# Altium schematic sheet SuperFin Baseboard pg5.SchDoc
size A
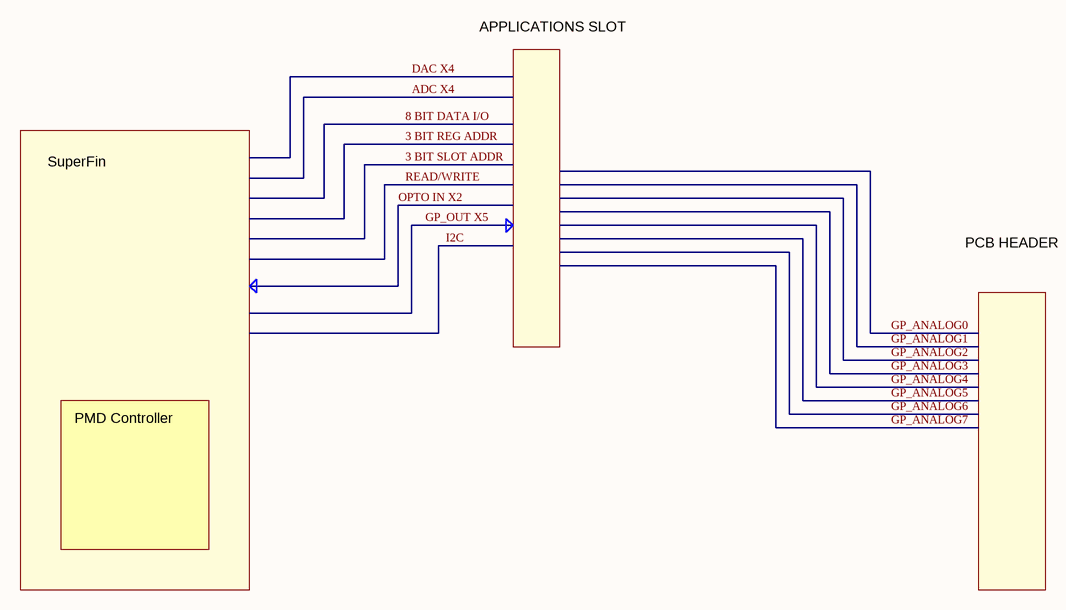
[diagram p0: SuperFin Baseboard pg5.SchDoc]

## Buses and harness runs
bus 3 BIT REG ADDR
bus 3 BIT SLOT ADDR
bus 8 BIT DATA I/O
bus ADC X4
bus DAC X4
bus GP_OUT X5
bus I2C
bus OPTO IN X2

## Notes on the sheet
- APPLICATIONS SLOT
- SuperFin
- PCB HEADER
- PMD Controller